# EAGLE schematic 15TB (EAGLE 9.6.0), part 1 of 2

## Sheet 1 of 4
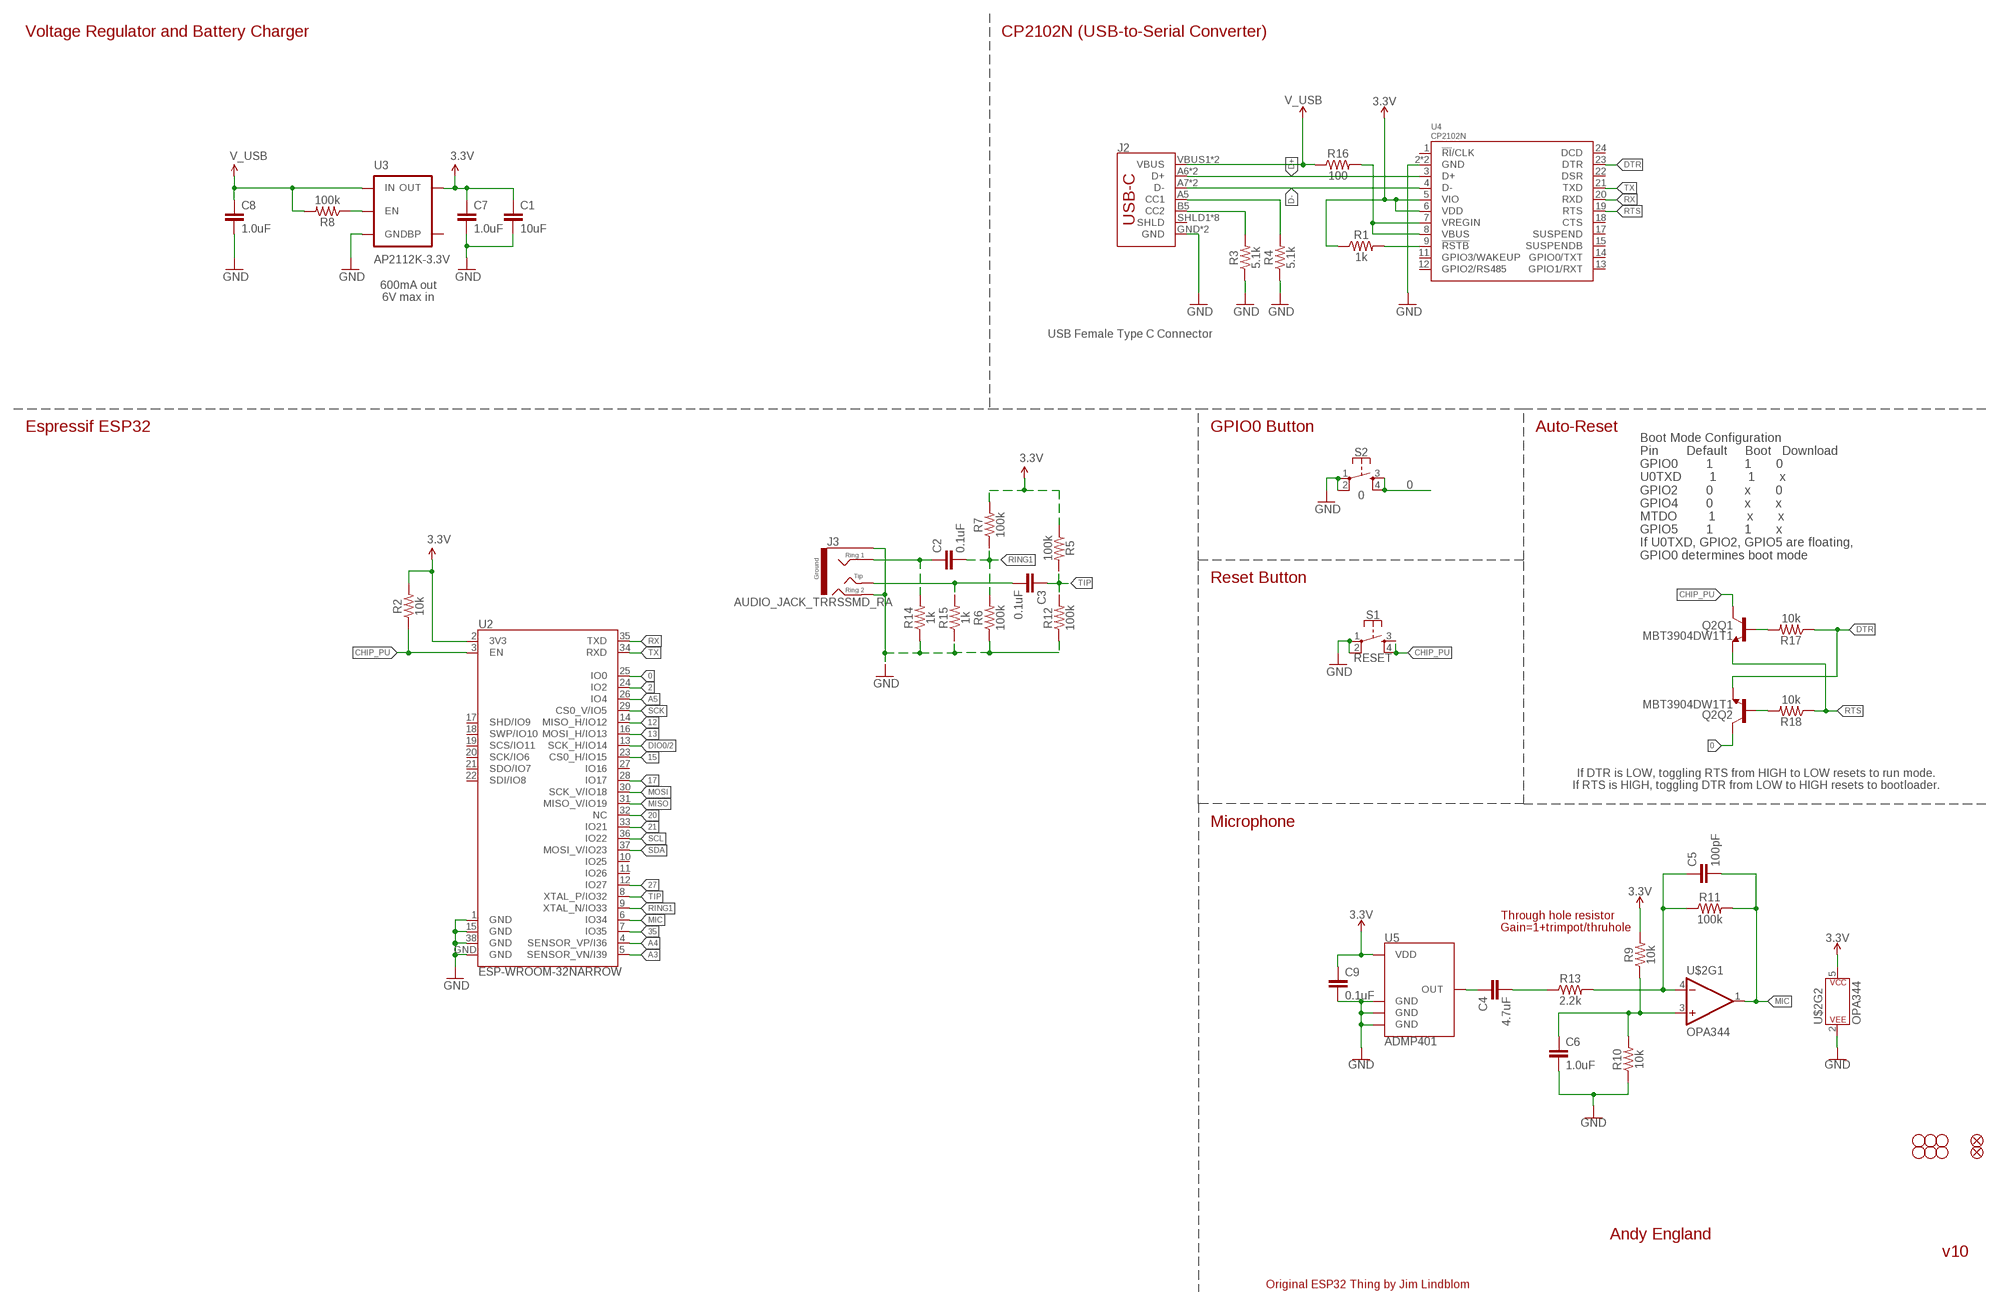
[diagram p0: schematic, sheet 1]

### Parts
C1  10uF  10UF-0603-6.3V-20%  [0603]
C2  0.1uF  0.1UF-0603-25V-5%  [0603]
C3  0.1uF  0.1UF-0603-25V-5%  [0603]
C4  4.7uF  4.7UF-0603-6.3V-(10%)  [0603]
C5  100pF  100PF-0603-50V-5%  [0603]
C6  1.0uF  1.0UF-0603-16V-10%  [0603]
C7  1.0uF  1.0UF-0603-16V-10%  [0603]
C8  1.0uF  1.0UF-0603-16V-10%  [0603]
C9  0.1uF  0.1UF-0603-25V-5%  [0603]
FD1  FIDUCIALUFIDUCIAL  [FIDUCIAL-MICRO]
FD4  FIDUCIALUFIDUCIAL  [FIDUCIAL-MICRO]
H1  STAND-OFF  [STAND-OFF]
H2  STAND-OFF  [STAND-OFF]
H3  STAND-OFF  [STAND-OFF]
H4  STAND-OFF  [STAND-OFF]
H5  STAND-OFF  [STAND-OFF]
H6  STAND-OFF  [STAND-OFF]
J2  USB Female Type C Connector  USB_C  [USB-C-16P]
J3  AUDIO_JACK_TRRSSMD_RA  [AUDIO_JACK_3.5MM_TRRS_SMD_RA]
Q2  MBT3904DW1T1  TRANS_NPN_DUAL-MBT3904DW1T1  [SC70-6]
R1  1k  1KOHM-0603-1/10W-1%  [0603]
R2  10k  10KOHM-0603-1/10W-1%  [0603]
R3  5.1k  5.1KOHM5.1KOHM-0603-1/10W-1%  [0603]
R4  5.1k  5.1KOHM5.1KOHM-0603-1/10W-1%  [0603]
R5  100k  100KOHM-0603-1/10W-1%  [0603]
R6  100k  100KOHM-0603-1/10W-1%  [0603]
R7  100k  100KOHM-0603-1/10W-1%  [0603]
R8  100k  100KOHM-0603-1/10W-1%  [0603]
R9  10k  10KOHM-0603-1/10W-1%  [0603]
R10  10k  10KOHM-0603-1/10W-1%  [0603]
R11  100k  100KOHM-0603-1/10W-1%  [0603]
R12  100k  100KOHM-0603-1/10W-1%  [0603]
R13  2.2k  2.2KOHM-0603-1/10W-1%  [0603]
R14  1k  1KOHM-0603-1/10W-1%  [0603]
R15  1k  1KOHM-0603-1/10W-1%  [0603]
R16  100  100OHM-0603-1/10W-1%  [0603]
R17  10k  10KOHM-0603-1/10W-1%  [0603]
R18  10k  10KOHM-0603-1/10W-1%  [0603]
S1  RESET  MOMENTARY-SWITCH-SPST-2-SMD-4.6X2.8MM  [TACTILE_SWITCH_SMD_4.6X2.8MM]
S2  0  MOMENTARY-SWITCH-SPST-2-SMD-4.6X2.8MM  [TACTILE_SWITCH_SMD_4.6X2.8MM]
U2  ESP-WROOM-32NARROW  [ESP-WROOM-32-NARROW]
U3  AP2112K-3.3V  V_REG_LDOSMD  [SOT23-5]
U4  CP2102N  [QFN24]
U5  ADMP401  [ADMP401]
U$2  OPA344  [SOT23-5]

### Nets
0: Q2.6(Q2:C) S2.3 S2.4 U2.25(IO0)
2: U2.24(IO2)
3.3V: C1.1 C7.1 C9.1 R1.1 R2.2 R5.1 R7.2 R9.2 U2.2(3V3) U3.5(OUT) U4.5(VIO) U4.6(VDD) U5.5(VDD) U$2.5(P$V+)
12: U2.14(MISO_H/IO12)
13: U2.16(MOSI_H/IO13)
15: U2.23(CS0_H/IO15)
17: U2.28(IO17)
20: U2.32(NC)
21: U2.33(IO21)
27: U2.12(IO27)
35: U2.7(IO35)
A3: U2.5(SENSOR_VN/I39)
A4: U2.4(SENSOR_VP/I36)
A5: U2.26(IO4)
CHIP_PU: Q2.3(Q1:C) R2.1 S1.3 S1.4 U2.3(EN)
D+: J2.A6(D+) J2.B6(D+) U4.3(D+)
D-: J2.A7(D-) J2.B7(D-) U4.4(D-)
DIO0: U2.13(SCK_H/IO14) ; also sheet 2,4
DTR: Q2.1(Q2:E) R17.1 U4.23(DTR)
EN: R8.1 U3.3(EN)
GND: C1.2 C6.2 C7.2 C8.2 C9.2 J2.GND J2.GND2(GND) J3.EARTH J3.RING2 R3.1 R4.1 R6.1 R10.1 R12.1 R14.1 R15.1 S1.1 S1.2 S2.1 S2.2 U2.1(GND) U2.15(GND) U2.38(GND) U2.GND U3.2(GND) U4.2(GND) U4.PAD(GND) U5.2(GND) U5.4(GND) U5.6(GND) U$2.2(P$V-) ; also sheet 2,3,4
MIC: C5.2 R11.2 U2.6(IO34) U$2.1(OUT)
MISO: U2.31(MISO_V/IO19)
MOSI: U2.30(SCK_V/IO18)
N$1: R1.2 U4.9(!RSTB)
N$3: J2.B5(CC2) R3.2
N$4: J2.A5(CC1) R4.2
N$5: C4.1 U5.1(OUT)
N$6: C3.2 J3.TIP R15.2
N$7: C2.1 J3.RING1 R14.2
N$9: C5.1 R11.1 R13.2 U$2.4(-IN)
N$10: Q2.5(Q1:B) R17.2
N$11: C4.2 R13.1
N$12: Q2.2(Q2:B) R18.2
N$16: C6.1 R9.1 R10.2 U$2.3(+IN)
N$137: R16.2 U4.7(VREGIN) U4.8(VBUS)
RING1: C2.2 R6.2 R7.1 U2.9(XTAL_N/IO33)
RTS: Q2.4(Q1:E) R18.1 U4.19(RTS)
RX: U2.35(TXD) U4.20(RXD)
SCK: U2.29(CS0_V/IO5)
SCL: U2.36(IO22)
SDA: U2.37(MOSI_V/IO23)
TIP: C3.1 R5.2 R12.2 U2.8(XTAL_P/IO32)
TX: U2.34(RXD) U4.21(TXD)
V_USB: C8.1 J2.VBUS1(VBUS) J2.VBUS2(VBUS) R8.2 R16.1 U3.1(IN) ; also sheet 2,3,4
Unconnected: J2.SHLD1(SHLD) J2.SHLD2(SHLD) J2.SHLD3(SHLD) J2.SHLD4(SHLD) J2.SHLD5(SHLD) J2.SHLD6(SHLD) J2.SHLD7(SHLD) J2.SHLD8(SHLD) U2.10(IO25) U2.11(IO26) U2.17(SHD/IO9) U2.18(SWP/IO10) U2.19(SCS/IO11) U2.20(SCK/IO6) U2.21(SDO/IO7) U2.22(SDI/IO8) U2.27(IO16) U3.4(BP) U4.1(!RI!/CLK) U4.11(GPIO3/WAKEUP) U4.12(GPIO2/RS485) U4.13(GPIO1/RXT) U4.14(GPIO0/TXT) U4.15(SUSPENDB) U4.17(SUSPEND) U4.18(CTS) U4.22(DSR) U4.24(DCD)

### Notes on the sheet
- Voltage Regulator and Battery Charger | CP2102N (USB-to-Serial Converter)
- 600mA out
  6V max in
- Espressif ESP32 | GPIO0 Button | Auto-Reset
- Boot Mode Configuration
  Pin        Default     Boot   Download
  GPIO0        1         1       0
  U0TXD        1         1       x
  GPIO2        0         x       0
  GPIO4        0         x       x
  MTDO         1         x       x
  GPIO5        1         1       x
  If U0TXD, GPIO2, GPIO5 are floating, 
  GPIO0 determines boot mode
- Reset Button
- If DTR is LOW, toggling RTS from HIGH to LOW resets to run mode.
  If RTS is HIGH, toggling DTR from LOW to HIGH resets to bootloader.
- Microphone
- Through hole resistor
  Gain=1+trimpot/thruhole
- Andy England
- v10
- Original ESP32 Thing by Jim Lindblom

## Sheet 2 of 4
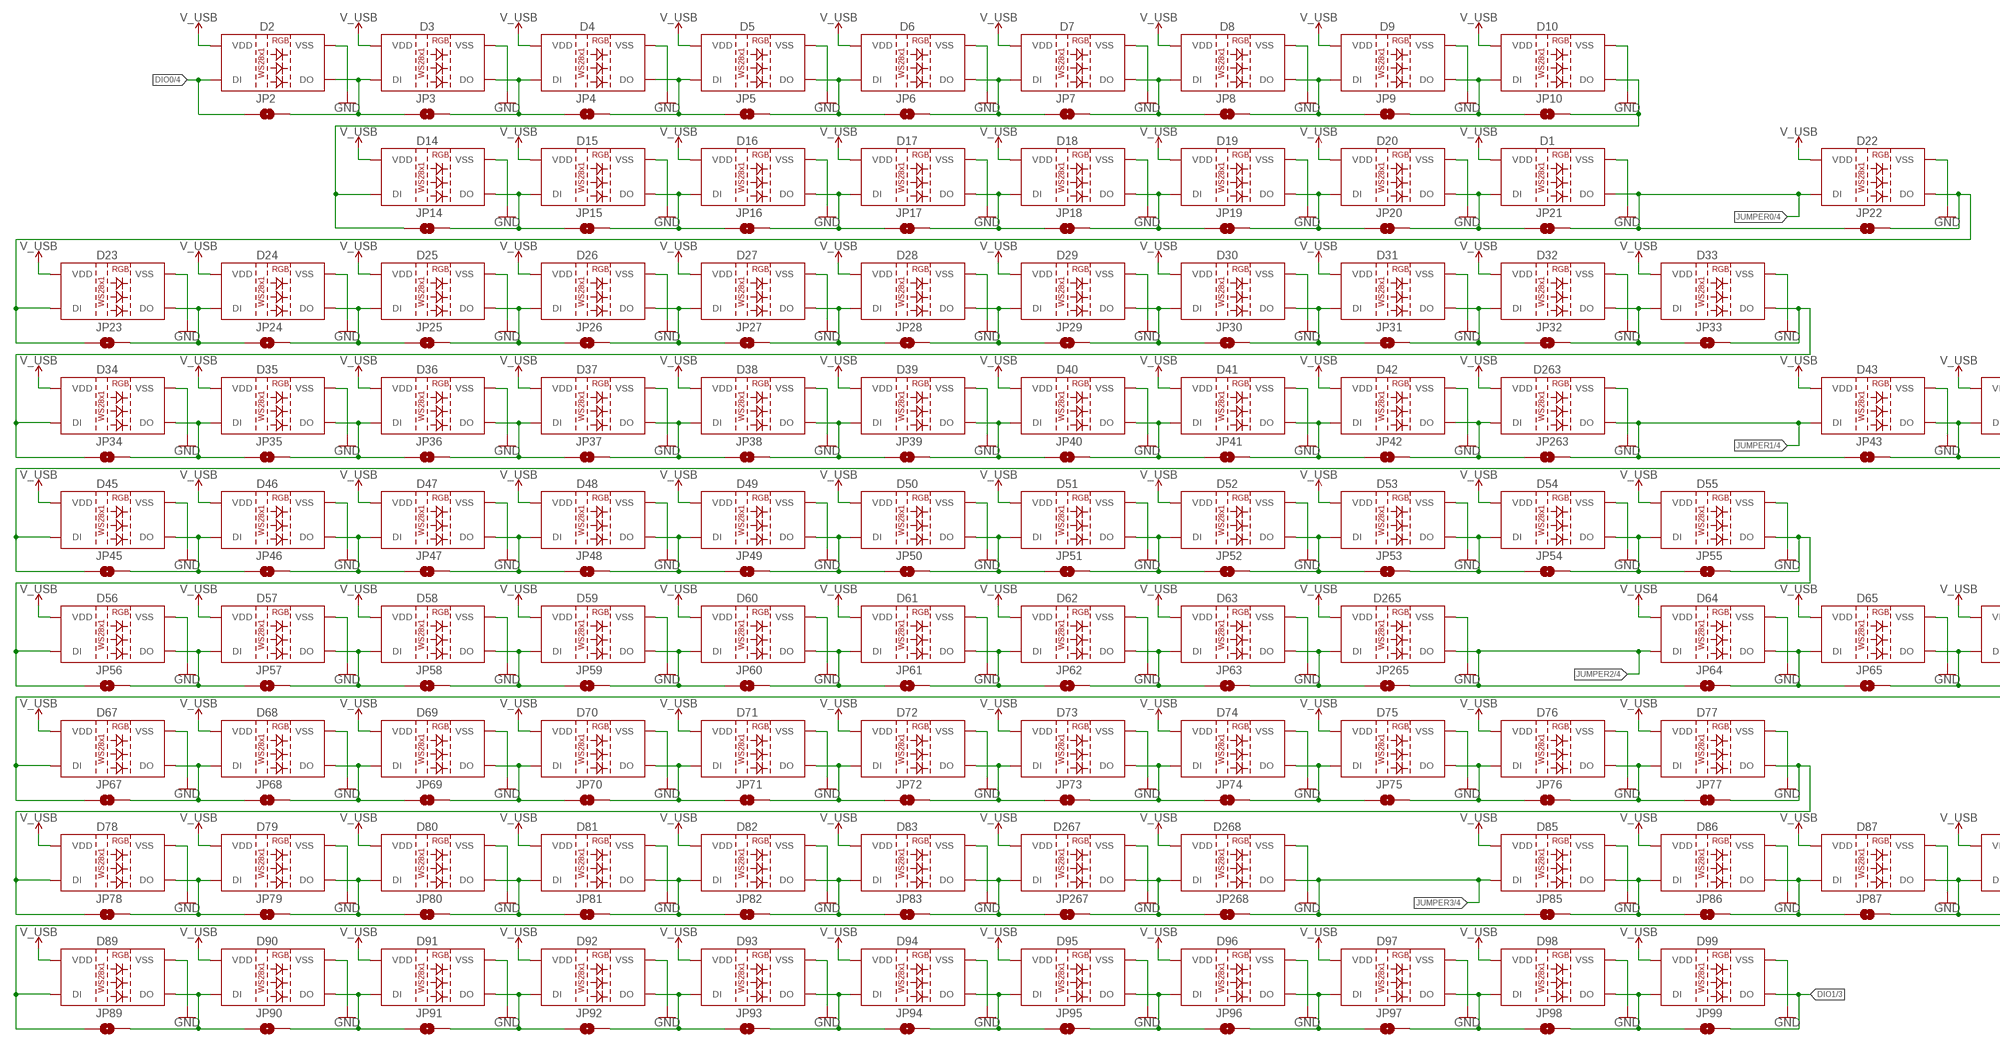
[diagram p1: schematic, sheet 2, part 1 of 2]
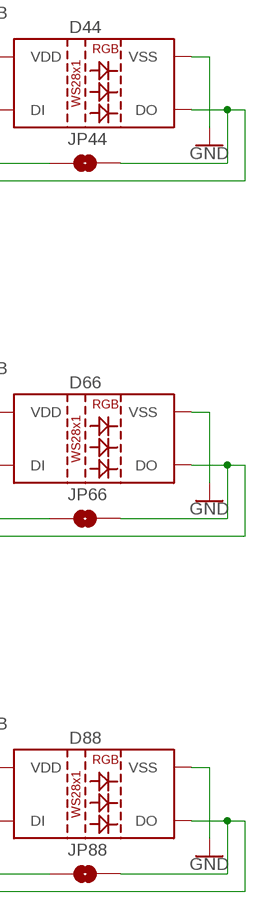
[diagram p2: schematic, sheet 2, part 2 of 2]

### Parts
D1  WS2812B  [WS2812B]
D2  WS2812B  [WS2812B]
D3  WS2812B  [WS2812B]
D4  WS2812B  [WS2812B]
D5  WS2812B  [WS2812B]
D6  WS2812B  [WS2812B]
D7  WS2812B  [WS2812B]
D8  WS2812B  [WS2812B]
D9  WS2812B  [WS2812B]
D10  WS2812B  [WS2812B]
D14  WS2812B  [WS2812B]
D15  WS2812B  [WS2812B]
D16  WS2812B  [WS2812B]
D17  WS2812B  [WS2812B]
D18  WS2812B  [WS2812B]
D19  WS2812B  [WS2812B]
D20  WS2812B  [WS2812B]
D22  WS2812B  [WS2812B]
D23  WS2812B  [WS2812B]
D24  WS2812B  [WS2812B]
D25  WS2812B  [WS2812B]
D26  WS2812B  [WS2812B]
D27  WS2812B  [WS2812B]
D28  WS2812B  [WS2812B]
D29  WS2812B  [WS2812B]
D30  WS2812B  [WS2812B]
D31  WS2812B  [WS2812B]
D32  WS2812B  [WS2812B]
D33  WS2812B  [WS2812B]
D34  WS2812B  [WS2812B]
D35  WS2812B  [WS2812B]
D36  WS2812B  [WS2812B]
D37  WS2812B  [WS2812B]
D38  WS2812B  [WS2812B]
D39  WS2812B  [WS2812B]
D40  WS2812B  [WS2812B]
D41  WS2812B  [WS2812B]
D42  WS2812B  [WS2812B]
D43  WS2812B  [WS2812B]
D44  WS2812B  [WS2812B]
D45  WS2812B  [WS2812B]
D46  WS2812B  [WS2812B]
D47  WS2812B  [WS2812B]
D48  WS2812B  [WS2812B]
D49  WS2812B  [WS2812B]
D50  WS2812B  [WS2812B]
D51  WS2812B  [WS2812B]
D52  WS2812B  [WS2812B]
D53  WS2812B  [WS2812B]
D54  WS2812B  [WS2812B]
D55  WS2812B  [WS2812B]
D56  WS2812B  [WS2812B]
D57  WS2812B  [WS2812B]
D58  WS2812B  [WS2812B]
D59  WS2812B  [WS2812B]
D60  WS2812B  [WS2812B]
D61  WS2812B  [WS2812B]
D62  WS2812B  [WS2812B]
D63  WS2812B  [WS2812B]
D64  WS2812B  [WS2812B]
D65  WS2812B  [WS2812B]
D66  WS2812B  [WS2812B]
D67  WS2812B  [WS2812B]
D68  WS2812B  [WS2812B]
D69  WS2812B  [WS2812B]
D70  WS2812B  [WS2812B]
D71  WS2812B  [WS2812B]
D72  WS2812B  [WS2812B]
D73  WS2812B  [WS2812B]
D74  WS2812B  [WS2812B]
D75  WS2812B  [WS2812B]
D76  WS2812B  [WS2812B]
D77  WS2812B  [WS2812B]
D78  WS2812B  [WS2812B]
D79  WS2812B  [WS2812B]
D80  WS2812B  [WS2812B]
D81  WS2812B  [WS2812B]
D82  WS2812B  [WS2812B]
D83  WS2812B  [WS2812B]
D85  WS2812B  [WS2812B]
D86  WS2812B  [WS2812B]
D87  WS2812B  [WS2812B]
D88  WS2812B  [WS2812B]
D89  WS2812B  [WS2812B]
D90  WS2812B  [WS2812B]
D91  WS2812B  [WS2812B]
D92  WS2812B  [WS2812B]
D93  WS2812B  [WS2812B]
D94  WS2812B  [WS2812B]
D95  WS2812B  [WS2812B]
D96  WS2812B  [WS2812B]
D97  WS2812B  [WS2812B]
D98  WS2812B  [WS2812B]
D99  WS2812B  [WS2812B]
D263  WS2812B  [WS2812B]
D265  WS2812B  [WS2812B]
D267  WS2812B  [WS2812B]
D268  WS2812B  [WS2812B]
JP2  JUMPER-SMT_2_NO_NO-SILK  [SMT-JUMPER_2_NO_NO-SILK]
JP3  JUMPER-SMT_2_NO_NO-SILK  [SMT-JUMPER_2_NO_NO-SILK]
JP4  JUMPER-SMT_2_NO_NO-SILK  [SMT-JUMPER_2_NO_NO-SILK]
JP5  JUMPER-SMT_2_NO_NO-SILK  [SMT-JUMPER_2_NO_NO-SILK]
JP6  JUMPER-SMT_2_NO_NO-SILK  [SMT-JUMPER_2_NO_NO-SILK]
JP7  JUMPER-SMT_2_NO_NO-SILK  [SMT-JUMPER_2_NO_NO-SILK]
JP8  JUMPER-SMT_2_NO_NO-SILK  [SMT-JUMPER_2_NO_NO-SILK]
JP9  JUMPER-SMT_2_NO_NO-SILK  [SMT-JUMPER_2_NO_NO-SILK]
JP10  JUMPER-SMT_2_NO_NO-SILK  [SMT-JUMPER_2_NO_NO-SILK]
JP14  JUMPER-SMT_2_NO_NO-SILK  [SMT-JUMPER_2_NO_NO-SILK]
JP15  JUMPER-SMT_2_NO_NO-SILK  [SMT-JUMPER_2_NO_NO-SILK]
JP16  JUMPER-SMT_2_NO_NO-SILK  [SMT-JUMPER_2_NO_NO-SILK]
JP17  JUMPER-SMT_2_NO_NO-SILK  [SMT-JUMPER_2_NO_NO-SILK]
JP18  JUMPER-SMT_2_NO_NO-SILK  [SMT-JUMPER_2_NO_NO-SILK]
JP19  JUMPER-SMT_2_NO_NO-SILK  [SMT-JUMPER_2_NO_NO-SILK]
JP20  JUMPER-SMT_2_NO_NO-SILK  [SMT-JUMPER_2_NO_NO-SILK]
JP21  JUMPER-SMT_2_NO_NO-SILK  [SMT-JUMPER_2_NO_NO-SILK]
JP22  JUMPER-SMT_2_NO_NO-SILK  [SMT-JUMPER_2_NO_NO-SILK]
JP23  JUMPER-SMT_2_NO_NO-SILK  [SMT-JUMPER_2_NO_NO-SILK]
JP24  JUMPER-SMT_2_NO_NO-SILK  [SMT-JUMPER_2_NO_NO-SILK]
JP25  JUMPER-SMT_2_NO_NO-SILK  [SMT-JUMPER_2_NO_NO-SILK]
JP26  JUMPER-SMT_2_NO_NO-SILK  [SMT-JUMPER_2_NO_NO-SILK]
JP27  JUMPER-SMT_2_NO_NO-SILK  [SMT-JUMPER_2_NO_NO-SILK]
JP28  JUMPER-SMT_2_NO_NO-SILK  [SMT-JUMPER_2_NO_NO-SILK]
JP29  JUMPER-SMT_2_NO_NO-SILK  [SMT-JUMPER_2_NO_NO-SILK]
JP30  JUMPER-SMT_2_NO_NO-SILK  [SMT-JUMPER_2_NO_NO-SILK]
JP31  JUMPER-SMT_2_NO_NO-SILK  [SMT-JUMPER_2_NO_NO-SILK]
JP32  JUMPER-SMT_2_NO_NO-SILK  [SMT-JUMPER_2_NO_NO-SILK]
JP33  JUMPER-SMT_2_NO_NO-SILK  [SMT-JUMPER_2_NO_NO-SILK]
JP34  JUMPER-SMT_2_NO_NO-SILK  [SMT-JUMPER_2_NO_NO-SILK]
JP35  JUMPER-SMT_2_NO_NO-SILK  [SMT-JUMPER_2_NO_NO-SILK]
JP36  JUMPER-SMT_2_NO_NO-SILK  [SMT-JUMPER_2_NO_NO-SILK]
JP37  JUMPER-SMT_2_NO_NO-SILK  [SMT-JUMPER_2_NO_NO-SILK]
JP38  JUMPER-SMT_2_NO_NO-SILK  [SMT-JUMPER_2_NO_NO-SILK]
JP39  JUMPER-SMT_2_NO_NO-SILK  [SMT-JUMPER_2_NO_NO-SILK]
JP40  JUMPER-SMT_2_NO_NO-SILK  [SMT-JUMPER_2_NO_NO-SILK]
JP41  JUMPER-SMT_2_NO_NO-SILK  [SMT-JUMPER_2_NO_NO-SILK]
JP42  JUMPER-SMT_2_NO_NO-SILK  [SMT-JUMPER_2_NO_NO-SILK]
JP43  JUMPER-SMT_2_NO_NO-SILK  [SMT-JUMPER_2_NO_NO-SILK]
JP44  JUMPER-SMT_2_NO_NO-SILK  [SMT-JUMPER_2_NO_NO-SILK]
JP45  JUMPER-SMT_2_NO_NO-SILK  [SMT-JUMPER_2_NO_NO-SILK]
JP46  JUMPER-SMT_2_NO_NO-SILK  [SMT-JUMPER_2_NO_NO-SILK]
JP47  JUMPER-SMT_2_NO_NO-SILK  [SMT-JUMPER_2_NO_NO-SILK]
JP48  JUMPER-SMT_2_NO_NO-SILK  [SMT-JUMPER_2_NO_NO-SILK]
JP49  JUMPER-SMT_2_NO_NO-SILK  [SMT-JUMPER_2_NO_NO-SILK]
JP50  JUMPER-SMT_2_NO_NO-SILK  [SMT-JUMPER_2_NO_NO-SILK]
JP51  JUMPER-SMT_2_NO_NO-SILK  [SMT-JUMPER_2_NO_NO-SILK]
JP52  JUMPER-SMT_2_NO_NO-SILK  [SMT-JUMPER_2_NO_NO-SILK]
JP53  JUMPER-SMT_2_NO_NO-SILK  [SMT-JUMPER_2_NO_NO-SILK]
JP54  JUMPER-SMT_2_NO_NO-SILK  [SMT-JUMPER_2_NO_NO-SILK]
JP55  JUMPER-SMT_2_NO_NO-SILK  [SMT-JUMPER_2_NO_NO-SILK]
JP56  JUMPER-SMT_2_NO_NO-SILK  [SMT-JUMPER_2_NO_NO-SILK]
JP57  JUMPER-SMT_2_NO_NO-SILK  [SMT-JUMPER_2_NO_NO-SILK]
JP58  JUMPER-SMT_2_NO_NO-SILK  [SMT-JUMPER_2_NO_NO-SILK]
JP59  JUMPER-SMT_2_NO_NO-SILK  [SMT-JUMPER_2_NO_NO-SILK]
JP60  JUMPER-SMT_2_NO_NO-SILK  [SMT-JUMPER_2_NO_NO-SILK]
JP61  JUMPER-SMT_2_NO_NO-SILK  [SMT-JUMPER_2_NO_NO-SILK]
JP62  JUMPER-SMT_2_NO_NO-SILK  [SMT-JUMPER_2_NO_NO-SILK]
JP63  JUMPER-SMT_2_NO_NO-SILK  [SMT-JUMPER_2_NO_NO-SILK]
JP64  JUMPER-SMT_2_NO_NO-SILK  [SMT-JUMPER_2_NO_NO-SILK]
JP65  JUMPER-SMT_2_NO_NO-SILK  [SMT-JUMPER_2_NO_NO-SILK]
JP66  JUMPER-SMT_2_NO_NO-SILK  [SMT-JUMPER_2_NO_NO-SILK]
JP67  JUMPER-SMT_2_NO_NO-SILK  [SMT-JUMPER_2_NO_NO-SILK]
JP68  JUMPER-SMT_2_NO_NO-SILK  [SMT-JUMPER_2_NO_NO-SILK]
JP69  JUMPER-SMT_2_NO_NO-SILK  [SMT-JUMPER_2_NO_NO-SILK]
JP70  JUMPER-SMT_2_NO_NO-SILK  [SMT-JUMPER_2_NO_NO-SILK]
JP71  JUMPER-SMT_2_NO_NO-SILK  [SMT-JUMPER_2_NO_NO-SILK]
JP72  JUMPER-SMT_2_NO_NO-SILK  [SMT-JUMPER_2_NO_NO-SILK]
JP73  JUMPER-SMT_2_NO_NO-SILK  [SMT-JUMPER_2_NO_NO-SILK]
JP74  JUMPER-SMT_2_NO_NO-SILK  [SMT-JUMPER_2_NO_NO-SILK]
JP75  JUMPER-SMT_2_NO_NO-SILK  [SMT-JUMPER_2_NO_NO-SILK]
JP76  JUMPER-SMT_2_NO_NO-SILK  [SMT-JUMPER_2_NO_NO-SILK]
JP77  JUMPER-SMT_2_NO_NO-SILK  [SMT-JUMPER_2_NO_NO-SILK]
JP78  JUMPER-SMT_2_NO_NO-SILK  [SMT-JUMPER_2_NO_NO-SILK]
JP79  JUMPER-SMT_2_NO_NO-SILK  [SMT-JUMPER_2_NO_NO-SILK]
JP80  JUMPER-SMT_2_NO_NO-SILK  [SMT-JUMPER_2_NO_NO-SILK]
JP81  JUMPER-SMT_2_NO_NO-SILK  [SMT-JUMPER_2_NO_NO-SILK]
JP82  JUMPER-SMT_2_NO_NO-SILK  [SMT-JUMPER_2_NO_NO-SILK]
JP83  JUMPER-SMT_2_NO_NO-SILK  [SMT-JUMPER_2_NO_NO-SILK]
JP85  JUMPER-SMT_2_NO_NO-SILK  [SMT-JUMPER_2_NO_NO-SILK]
JP86  JUMPER-SMT_2_NO_NO-SILK  [SMT-JUMPER_2_NO_NO-SILK]
JP87  JUMPER-SMT_2_NO_NO-SILK  [SMT-JUMPER_2_NO_NO-SILK]
JP88  JUMPER-SMT_2_NO_NO-SILK  [SMT-JUMPER_2_NO_NO-SILK]
JP89  JUMPER-SMT_2_NO_NO-SILK  [SMT-JUMPER_2_NO_NO-SILK]
JP90  JUMPER-SMT_2_NO_NO-SILK  [SMT-JUMPER_2_NO_NO-SILK]
JP91  JUMPER-SMT_2_NO_NO-SILK  [SMT-JUMPER_2_NO_NO-SILK]
JP92  JUMPER-SMT_2_NO_NO-SILK  [SMT-JUMPER_2_NO_NO-SILK]
JP93  JUMPER-SMT_2_NO_NO-SILK  [SMT-JUMPER_2_NO_NO-SILK]
JP94  JUMPER-SMT_2_NO_NO-SILK  [SMT-JUMPER_2_NO_NO-SILK]
JP95  JUMPER-SMT_2_NO_NO-SILK  [SMT-JUMPER_2_NO_NO-SILK]
JP96  JUMPER-SMT_2_NO_NO-SILK  [SMT-JUMPER_2_NO_NO-SILK]
JP97  JUMPER-SMT_2_NO_NO-SILK  [SMT-JUMPER_2_NO_NO-SILK]
JP98  JUMPER-SMT_2_NO_NO-SILK  [SMT-JUMPER_2_NO_NO-SILK]
JP99  JUMPER-SMT_2_NO_NO-SILK  [SMT-JUMPER_2_NO_NO-SILK]
JP263  JUMPER-SMT_2_NO_NO-SILK  [SMT-JUMPER_2_NO_NO-SILK]
JP265  JUMPER-SMT_2_NO_NO-SILK  [SMT-JUMPER_2_NO_NO-SILK]
JP267  JUMPER-SMT_2_NO_NO-SILK  [SMT-JUMPER_2_NO_NO-SILK]
JP268  JUMPER-SMT_2_NO_NO-SILK  [SMT-JUMPER_2_NO_NO-SILK]

### Nets
DIO0: D2.4(DI) JP2.1 ; also sheet 1,4
DIO1: D99.2(DO) JP99.2 ; also sheet 3
DIO3: D6.2(DO) D7.4(DI) JP6.2 JP7.1
DIO4: D8.2(DO) D9.4(DI) JP8.2 JP9.1
DIO7: D15.2(DO) D16.4(DI) JP15.2 JP16.1
DIO8: D17.2(DO) D18.4(DI) JP17.2 JP18.1
DIO9: D19.2(DO) D20.4(DI) JP19.2 JP20.1
DIO11: D22.2(DO) D23.4(DI) JP22.2 JP23.1
DIO12: D24.2(DO) D25.4(DI) JP24.2 JP25.1
DIO13: D26.2(DO) D27.4(DI) JP26.2 JP27.1
DIO14: D28.2(DO) D29.4(DI) JP28.2 JP29.1
DIO15: D30.2(DO) D31.4(DI) JP30.2 JP31.1
DIO16: D32.2(DO) D33.4(DI) JP32.2 JP33.1
DIO17: D33.2(DO) D34.4(DI) JP33.2 JP34.1
DIO18: D35.2(DO) D36.4(DI) JP35.2 JP36.1
DIO19: D37.2(DO) D38.4(DI) JP37.2 JP38.1
DIO20: D39.2(DO) D40.4(DI) JP39.2 JP40.1
DIO21: D41.2(DO) D42.4(DI) JP41.2 JP42.1
DIO22: D43.2(DO) D44.4(DI) JP43.2 JP44.1
DIO23: D44.2(DO) D45.4(DI) JP44.2 JP45.1
DIO24: D46.2(DO) D47.4(DI) JP46.2 JP47.1
DIO25: D48.2(DO) D49.4(DI) JP48.2 JP49.1
DIO26: D50.2(DO) D51.4(DI) JP50.2 JP51.1
DIO27: D52.2(DO) D53.4(DI) JP52.2 JP53.1
DIO28: D54.2(DO) D55.4(DI) JP54.2 JP55.1
DIO29: D55.2(DO) D56.4(DI) JP55.2 JP56.1
DIO30: D57.2(DO) D58.4(DI) JP57.2 JP58.1
DIO31: D59.2(DO) D60.4(DI) JP59.2 JP60.1
DIO32: D61.2(DO) D62.4(DI) JP61.2 JP62.1
DIO33: D267.2(DO) D268.4(DI) JP267.2 JP268.1
DIO34: D65.2(DO) D66.4(DI) JP65.2 JP66.1
DIO35: D66.2(DO) D67.4(DI) JP66.2 JP67.1
DIO36: D68.2(DO) D69.4(DI) JP68.2 JP69.1
DIO37: D70.2(DO) D71.4(DI) JP70.2 JP71.1
DIO38: D72.2(DO) D73.4(DI) JP72.2 JP73.1
DIO39: D74.2(DO) D75.4(DI) JP74.2 JP75.1
DIO40: D76.2(DO) D77.4(DI) JP76.2 JP77.1
DIO41: D77.2(DO) D78.4(DI) JP77.2 JP78.1
DIO42: D79.2(DO) D80.4(DI) JP79.2 JP80.1
DIO43: D81.2(DO) D82.4(DI) JP81.2 JP82.1
DIO45: D85.2(DO) D86.4(DI) JP85.2 JP86.1
DIO46: D87.2(DO) D88.4(DI) JP87.2 JP88.1
DIO47: D88.2(DO) D89.4(DI) JP88.2 JP89.1
DIO48: D90.2(DO) D91.4(DI) JP90.2 JP91.1
DIO49: D92.2(DO) D93.4(DI) JP92.2 JP93.1
DIO50: D94.2(DO) D95.4(DI) JP94.2 JP95.1
DIO51: D96.2(DO) D97.4(DI) JP96.2 JP97.1
DIO52: D98.2(DO) D99.4(DI) JP98.2 JP99.1
GND: D1.3(VSS) D2.3(VSS) D3.3(VSS) D4.3(VSS) D5.3(VSS) D6.3(VSS) D7.3(VSS) D8.3(VSS) D9.3(VSS) D10.3(VSS) D14.3(VSS) D15.3(VSS) D16.3(VSS) D17.3(VSS) D18.3(VSS) D19.3(VSS) D20.3(VSS) D22.3(VSS) D23.3(VSS) D24.3(VSS) D25.3(VSS) D26.3(VSS) D27.3(VSS) D28.3(VSS) D29.3(VSS) D30.3(VSS) D31.3(VSS) D32.3(VSS) D33.3(VSS) D34.3(VSS) D35.3(VSS) D36.3(VSS) D37.3(VSS) D38.3(VSS) D39.3(VSS) D40.3(VSS) D41.3(VSS) D42.3(VSS) D43.3(VSS) D44.3(VSS) D45.3(VSS) D46.3(VSS) D47.3(VSS) D48.3(VSS) D49.3(VSS) D50.3(VSS) D51.3(VSS) D52.3(VSS) D53.3(VSS) D54.3(VSS) D55.3(VSS) D56.3(VSS) D57.3(VSS) D58.3(VSS) D59.3(VSS) D60.3(VSS) D61.3(VSS) D62.3(VSS) D63.3(VSS) D64.3(VSS) D65.3(VSS) D66.3(VSS) D67.3(VSS) D68.3(VSS) D69.3(VSS) D70.3(VSS) D71.3(VSS) D72.3(VSS) D73.3(VSS) D74.3(VSS) D75.3(VSS) D76.3(VSS) D77.3(VSS) D78.3(VSS) D79.3(VSS) D80.3(VSS) D81.3(VSS) D82.3(VSS) D83.3(VSS) D85.3(VSS) D86.3(VSS) D87.3(VSS) D88.3(VSS) D89.3(VSS) D90.3(VSS) D91.3(VSS) D92.3(VSS) D93.3(VSS) D94.3(VSS) D95.3(VSS) D96.3(VSS) D97.3(VSS) D98.3(VSS) D99.3(VSS) D263.3(VSS) D265.3(VSS) D267.3(VSS) D268.3(VSS) ; also sheet 1,3,4
JUMPER0: D1.2(DO) D22.4(DI) JP21.2 JP22.1 ; also sheet 4
JUMPER1: D43.4(DI) D263.2(DO) JP43.1 JP263.2 ; also sheet 4
JUMPER2: D64.4(DI) D265.2(DO) JP64.1 JP265.2 ; also sheet 4
JUMPER3: D85.4(DI) D268.2(DO) JP85.1 JP268.2 ; also sheet 4
N$2: D1.4(DI) D20.2(DO) JP20.2 JP21.1
N$8: D10.2(DO) D14.4(DI) JP10.2 JP14.1
N$13: D3.2(DO) D4.4(DI) JP3.2 JP4.1
N$14: D5.2(DO) D6.4(DI) JP5.2 JP6.1
N$15: D9.2(DO) D10.4(DI) JP9.2 JP10.1
N$17: D7.2(DO) D8.4(DI) JP7.2 JP8.1
N$18: D16.2(DO) D17.4(DI) JP16.2 JP17.1
N$19: D23.2(DO) D24.4(DI) JP23.2 JP24.1
N$20: D14.2(DO) D15.4(DI) JP14.2 JP15.1
N$22: D18.2(DO) D19.4(DI) JP18.2 JP19.1
N$24: D27.2(DO) D28.4(DI) JP27.2 JP28.1
N$25: D25.2(DO) D26.4(DI) JP25.2 JP26.1
N$26: D31.2(DO) D32.4(DI) JP31.2 JP32.1
N$27: D29.2(DO) D30.4(DI) JP29.2 JP30.1
N$29: D34.2(DO) D35.4(DI) JP34.2 JP35.1
N$30: D38.2(DO) D39.4(DI) JP38.2 JP39.1
N$31: D36.2(DO) D37.4(DI) JP36.2 JP37.1
N$32: D42.2(DO) D263.4(DI) JP42.2 JP263.1
N$33: D40.2(DO) D41.4(DI) JP40.2 JP41.1
N$34: D45.2(DO) D46.4(DI) JP45.2 JP46.1
N$35: D49.2(DO) D50.4(DI) JP49.2 JP50.1
N$36: D47.2(DO) D48.4(DI) JP47.2 JP48.1
N$37: D53.2(DO) D54.4(DI) JP53.2 JP54.1
N$38: D51.2(DO) D52.4(DI) JP51.2 JP52.1
N$40: D56.2(DO) D57.4(DI) JP56.2 JP57.1
N$41: D60.2(DO) D61.4(DI) JP60.2 JP61.1
N$42: D58.2(DO) D59.4(DI) JP58.2 JP59.1
N$43: D64.2(DO) D65.4(DI) JP64.2 JP65.1
N$44: D62.2(DO) D63.4(DI) JP62.2 JP63.1
N$45: D67.2(DO) D68.4(DI) JP67.2 JP68.1
N$46: D71.2(DO) D72.4(DI) JP71.2 JP72.1
N$47: D69.2(DO) D70.4(DI) JP69.2 JP70.1
N$48: D75.2(DO) D76.4(DI) JP75.2 JP76.1
N$49: D73.2(DO) D74.4(DI) JP73.2 JP74.1
N$50: D78.2(DO) D79.4(DI) JP78.2 JP79.1
N$51: D82.2(DO) D83.4(DI) JP82.2 JP83.1
N$52: D80.2(DO) D81.4(DI) JP80.2 JP81.1
N$53: D86.2(DO) D87.4(DI) JP86.2 JP87.1
N$55: D89.2(DO) D90.4(DI) JP89.2 JP90.1
N$56: D93.2(DO) D94.4(DI) JP93.2 JP94.1
N$57: D91.2(DO) D92.4(DI) JP91.2 JP92.1
N$58: D97.2(DO) D98.4(DI) JP97.2 JP98.1
N$59: D95.2(DO) D96.4(DI) JP95.2 JP96.1
N$120: D2.2(DO) D3.4(DI) JP2.2 JP3.1
N$121: D4.2(DO) D5.4(DI) JP4.2 JP5.1
N$141: D63.2(DO) D265.4(DI) JP63.2 JP265.1
N$143: D83.2(DO) D267.4(DI) JP83.2 JP267.1
V_USB: D1.1(VDD) D2.1(VDD) D3.1(VDD) D4.1(VDD) D5.1(VDD) D6.1(VDD) D7.1(VDD) D8.1(VDD) D9.1(VDD) D10.1(VDD) D14.1(VDD) D15.1(VDD) D16.1(VDD) D17.1(VDD) D18.1(VDD) D19.1(VDD) D20.1(VDD) D22.1(VDD) D23.1(VDD) D24.1(VDD) D25.1(VDD) D26.1(VDD) D27.1(VDD) D28.1(VDD) D29.1(VDD) D30.1(VDD) D31.1(VDD) D32.1(VDD) D33.1(VDD) D34.1(VDD) D35.1(VDD) D36.1(VDD) D37.1(VDD) D38.1(VDD) D39.1(VDD) D40.1(VDD) D41.1(VDD) D42.1(VDD) D43.1(VDD) D44.1(VDD) D45.1(VDD) D46.1(VDD) D47.1(VDD) D48.1(VDD) D49.1(VDD) D50.1(VDD) D51.1(VDD) D52.1(VDD) D53.1(VDD) D54.1(VDD) D55.1(VDD) D56.1(VDD) D57.1(VDD) D58.1(VDD) D59.1(VDD) D60.1(VDD) D61.1(VDD) D62.1(VDD) D63.1(VDD) D64.1(VDD) D65.1(VDD) D66.1(VDD) D67.1(VDD) D68.1(VDD) D69.1(VDD) D70.1(VDD) D71.1(VDD) D72.1(VDD) D73.1(VDD) D74.1(VDD) D75.1(VDD) D76.1(VDD) D77.1(VDD) D78.1(VDD) D79.1(VDD) D80.1(VDD) D81.1(VDD) D82.1(VDD) D83.1(VDD) D85.1(VDD) D86.1(VDD) D87.1(VDD) D88.1(VDD) D89.1(VDD) D90.1(VDD) D91.1(VDD) D92.1(VDD) D93.1(VDD) D94.1(VDD) D95.1(VDD) D96.1(VDD) D97.1(VDD) D98.1(VDD) D99.1(VDD) D263.1(VDD) D265.1(VDD) D267.1(VDD) D268.1(VDD) ; also sheet 1,3,4

## Sheet 3 of 4
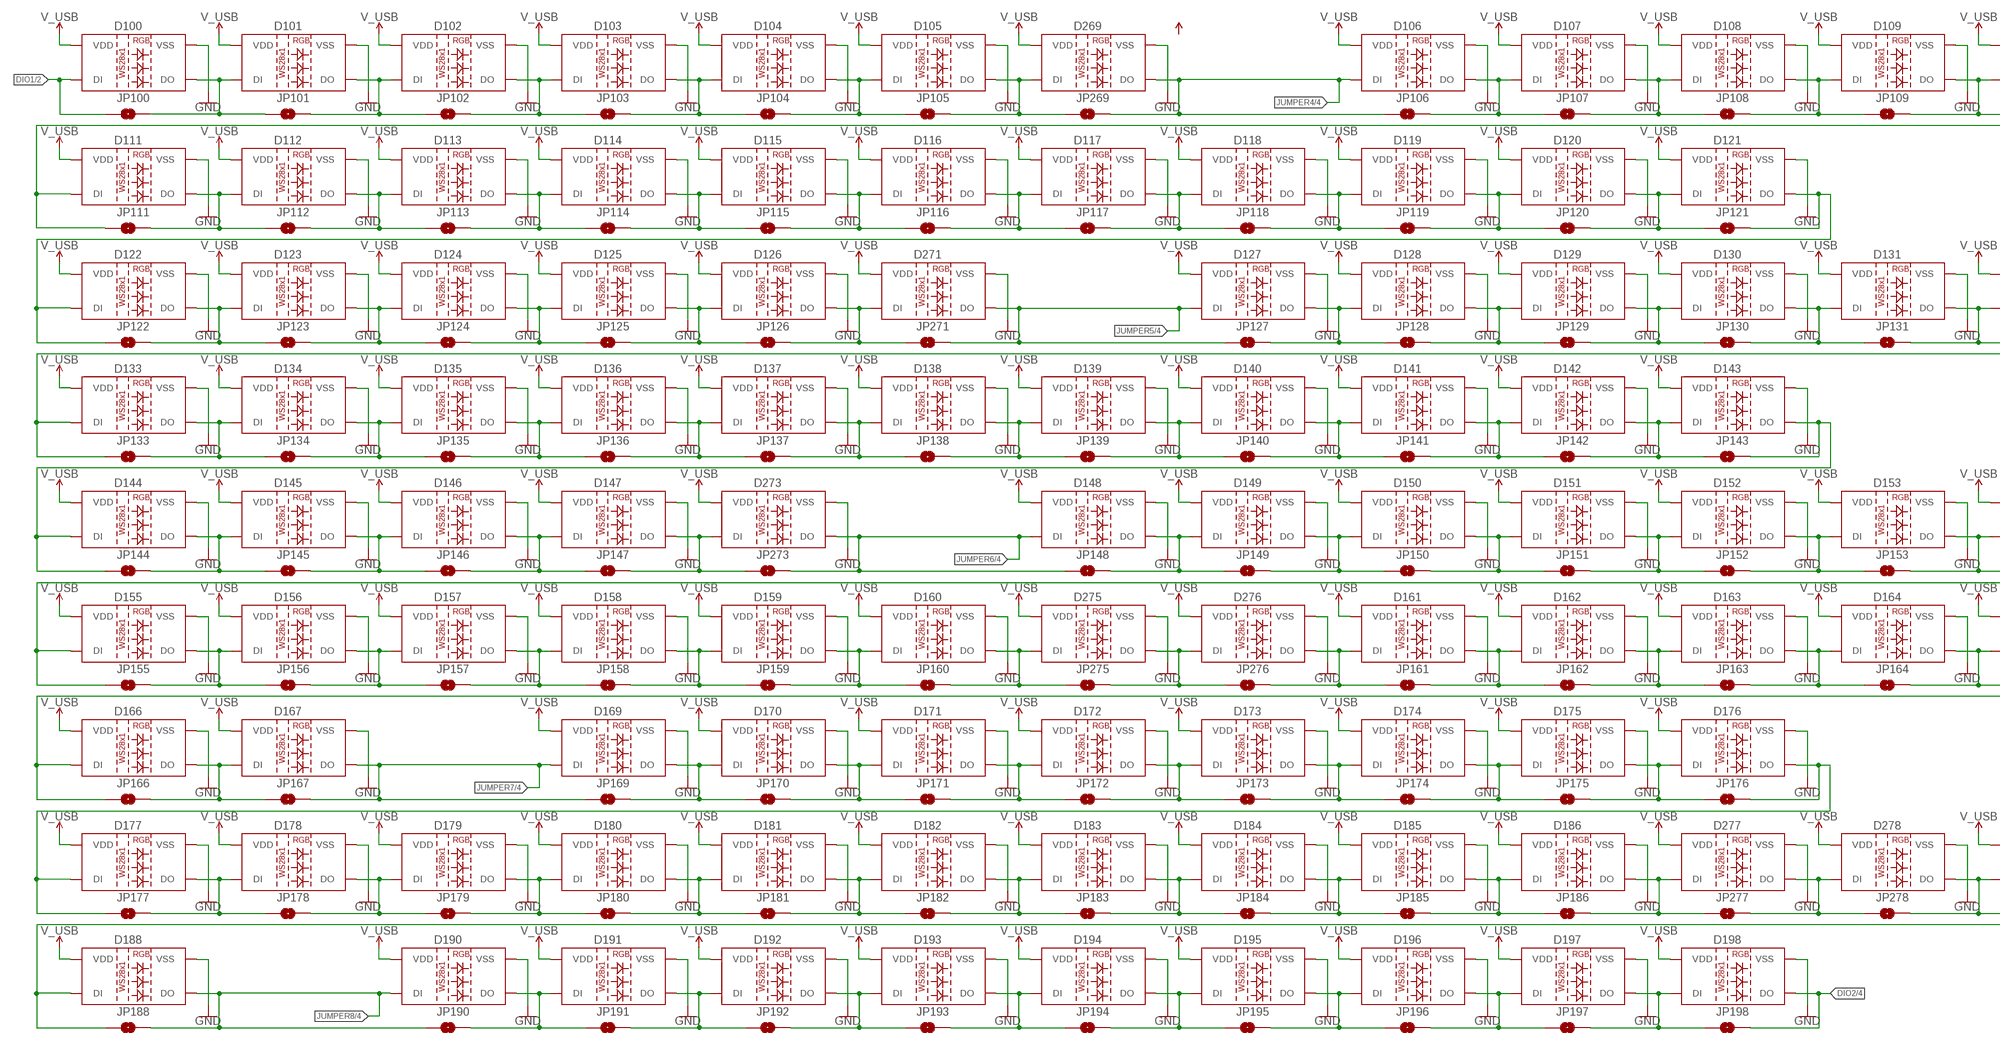
[diagram p3: schematic, sheet 3, part 1 of 2]
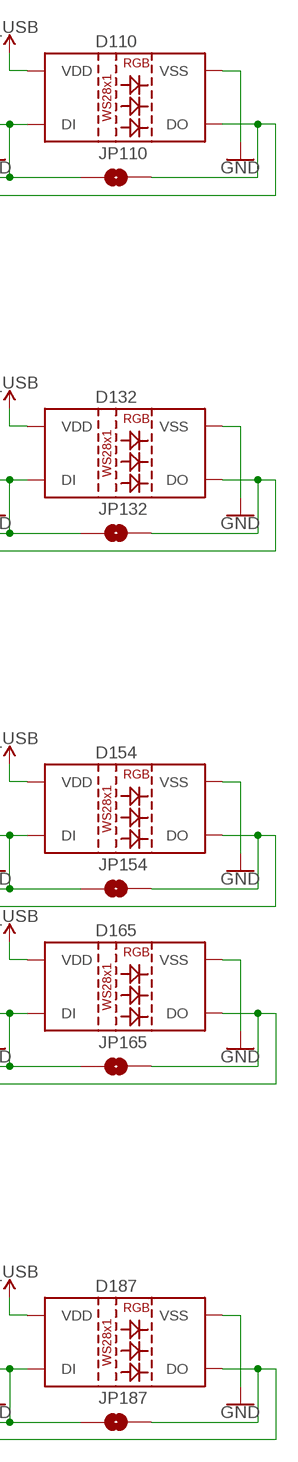
[diagram p4: schematic, sheet 3, part 2 of 2]

### Parts
D100  WS2812B  [WS2812B]
D101  WS2812B  [WS2812B]
D102  WS2812B  [WS2812B]
D103  WS2812B  [WS2812B]
D104  WS2812B  [WS2812B]
D105  WS2812B  [WS2812B]
D106  WS2812B  [WS2812B]
D107  WS2812B  [WS2812B]
D108  WS2812B  [WS2812B]
D109  WS2812B  [WS2812B]
D110  WS2812B  [WS2812B]
D111  WS2812B  [WS2812B]
D112  WS2812B  [WS2812B]
D113  WS2812B  [WS2812B]
D114  WS2812B  [WS2812B]
D115  WS2812B  [WS2812B]
D116  WS2812B  [WS2812B]
D117  WS2812B  [WS2812B]
D118  WS2812B  [WS2812B]
D119  WS2812B  [WS2812B]
D120  WS2812B  [WS2812B]
D121  WS2812B  [WS2812B]
D122  WS2812B  [WS2812B]
D123  WS2812B  [WS2812B]
D124  WS2812B  [WS2812B]
D125  WS2812B  [WS2812B]
D126  WS2812B  [WS2812B]
D127  WS2812B  [WS2812B]
D128  WS2812B  [WS2812B]
D129  WS2812B  [WS2812B]
D130  WS2812B  [WS2812B]
D131  WS2812B  [WS2812B]
D132  WS2812B  [WS2812B]
D133  WS2812B  [WS2812B]
D134  WS2812B  [WS2812B]
D135  WS2812B  [WS2812B]
D136  WS2812B  [WS2812B]
D137  WS2812B  [WS2812B]
D138  WS2812B  [WS2812B]
D139  WS2812B  [WS2812B]
D140  WS2812B  [WS2812B]
D141  WS2812B  [WS2812B]
D142  WS2812B  [WS2812B]
D143  WS2812B  [WS2812B]
D144  WS2812B  [WS2812B]
D145  WS2812B  [WS2812B]
D146  WS2812B  [WS2812B]
D147  WS2812B  [WS2812B]
D148  WS2812B  [WS2812B]
D149  WS2812B  [WS2812B]
D150  WS2812B  [WS2812B]
D151  WS2812B  [WS2812B]
D152  WS2812B  [WS2812B]
D153  WS2812B  [WS2812B]
D154  WS2812B  [WS2812B]
D155  WS2812B  [WS2812B]
D156  WS2812B  [WS2812B]
D157  WS2812B  [WS2812B]
D158  WS2812B  [WS2812B]
D159  WS2812B  [WS2812B]
D160  WS2812B  [WS2812B]
D161  WS2812B  [WS2812B]
D162  WS2812B  [WS2812B]
D163  WS2812B  [WS2812B]
D164  WS2812B  [WS2812B]
D165  WS2812B  [WS2812B]
D166  WS2812B  [WS2812B]
D167  WS2812B  [WS2812B]
D169  WS2812B  [WS2812B]
D170  WS2812B  [WS2812B]
D171  WS2812B  [WS2812B]
D172  WS2812B  [WS2812B]
D173  WS2812B  [WS2812B]
D174  WS2812B  [WS2812B]
D175  WS2812B  [WS2812B]
D176  WS2812B  [WS2812B]
D177  WS2812B  [WS2812B]
D178  WS2812B  [WS2812B]
D179  WS2812B  [WS2812B]
D180  WS2812B  [WS2812B]
D181  WS2812B  [WS2812B]
D182  WS2812B  [WS2812B]
D183  WS2812B  [WS2812B]
D184  WS2812B  [WS2812B]
D185  WS2812B  [WS2812B]
D186  WS2812B  [WS2812B]
D187  WS2812B  [WS2812B]
D188  WS2812B  [WS2812B]
D190  WS2812B  [WS2812B]
D191  WS2812B  [WS2812B]
D192  WS2812B  [WS2812B]
D193  WS2812B  [WS2812B]
D194  WS2812B  [WS2812B]
D195  WS2812B  [WS2812B]
D196  WS2812B  [WS2812B]
D197  WS2812B  [WS2812B]
D198  WS2812B  [WS2812B]
D269  WS2812B  [WS2812B]
D271  WS2812B  [WS2812B]
D273  WS2812B  [WS2812B]
D275  WS2812B  [WS2812B]
D276  WS2812B  [WS2812B]
D277  WS2812B  [WS2812B]
D278  WS2812B  [WS2812B]
JP100  JUMPER-SMT_2_NO_NO-SILK  [SMT-JUMPER_2_NO_NO-SILK]
JP101  JUMPER-SMT_2_NO_NO-SILK  [SMT-JUMPER_2_NO_NO-SILK]
JP102  JUMPER-SMT_2_NO_NO-SILK  [SMT-JUMPER_2_NO_NO-SILK]
JP103  JUMPER-SMT_2_NO_NO-SILK  [SMT-JUMPER_2_NO_NO-SILK]
JP104  JUMPER-SMT_2_NO_NO-SILK  [SMT-JUMPER_2_NO_NO-SILK]
JP105  JUMPER-SMT_2_NO_NO-SILK  [SMT-JUMPER_2_NO_NO-SILK]
JP106  JUMPER-SMT_2_NO_NO-SILK  [SMT-JUMPER_2_NO_NO-SILK]
JP107  JUMPER-SMT_2_NO_NO-SILK  [SMT-JUMPER_2_NO_NO-SILK]
JP108  JUMPER-SMT_2_NO_NO-SILK  [SMT-JUMPER_2_NO_NO-SILK]
JP109  JUMPER-SMT_2_NO_NO-SILK  [SMT-JUMPER_2_NO_NO-SILK]
JP110  JUMPER-SMT_2_NO_NO-SILK  [SMT-JUMPER_2_NO_NO-SILK]
JP111  JUMPER-SMT_2_NO_NO-SILK  [SMT-JUMPER_2_NO_NO-SILK]
JP112  JUMPER-SMT_2_NO_NO-SILK  [SMT-JUMPER_2_NO_NO-SILK]
JP113  JUMPER-SMT_2_NO_NO-SILK  [SMT-JUMPER_2_NO_NO-SILK]
JP114  JUMPER-SMT_2_NO_NO-SILK  [SMT-JUMPER_2_NO_NO-SILK]
JP115  JUMPER-SMT_2_NO_NO-SILK  [SMT-JUMPER_2_NO_NO-SILK]
JP116  JUMPER-SMT_2_NO_NO-SILK  [SMT-JUMPER_2_NO_NO-SILK]
JP117  JUMPER-SMT_2_NO_NO-SILK  [SMT-JUMPER_2_NO_NO-SILK]
JP118  JUMPER-SMT_2_NO_NO-SILK  [SMT-JUMPER_2_NO_NO-SILK]
JP119  JUMPER-SMT_2_NO_NO-SILK  [SMT-JUMPER_2_NO_NO-SILK]
JP120  JUMPER-SMT_2_NO_NO-SILK  [SMT-JUMPER_2_NO_NO-SILK]
JP121  JUMPER-SMT_2_NO_NO-SILK  [SMT-JUMPER_2_NO_NO-SILK]
JP122  JUMPER-SMT_2_NO_NO-SILK  [SMT-JUMPER_2_NO_NO-SILK]
JP123  JUMPER-SMT_2_NO_NO-SILK  [SMT-JUMPER_2_NO_NO-SILK]
JP124  JUMPER-SMT_2_NO_NO-SILK  [SMT-JUMPER_2_NO_NO-SILK]
JP125  JUMPER-SMT_2_NO_NO-SILK  [SMT-JUMPER_2_NO_NO-SILK]
JP126  JUMPER-SMT_2_NO_NO-SILK  [SMT-JUMPER_2_NO_NO-SILK]
JP127  JUMPER-SMT_2_NO_NO-SILK  [SMT-JUMPER_2_NO_NO-SILK]
JP128  JUMPER-SMT_2_NO_NO-SILK  [SMT-JUMPER_2_NO_NO-SILK]
JP129  JUMPER-SMT_2_NO_NO-SILK  [SMT-JUMPER_2_NO_NO-SILK]
JP130  JUMPER-SMT_2_NO_NO-SILK  [SMT-JUMPER_2_NO_NO-SILK]
JP131  JUMPER-SMT_2_NO_NO-SILK  [SMT-JUMPER_2_NO_NO-SILK]
JP132  JUMPER-SMT_2_NO_NO-SILK  [SMT-JUMPER_2_NO_NO-SILK]
JP133  JUMPER-SMT_2_NO_NO-SILK  [SMT-JUMPER_2_NO_NO-SILK]
JP134  JUMPER-SMT_2_NO_NO-SILK  [SMT-JUMPER_2_NO_NO-SILK]
JP135  JUMPER-SMT_2_NO_NO-SILK  [SMT-JUMPER_2_NO_NO-SILK]
JP136  JUMPER-SMT_2_NO_NO-SILK  [SMT-JUMPER_2_NO_NO-SILK]
JP137  JUMPER-SMT_2_NO_NO-SILK  [SMT-JUMPER_2_NO_NO-SILK]
JP138  JUMPER-SMT_2_NO_NO-SILK  [SMT-JUMPER_2_NO_NO-SILK]
JP139  JUMPER-SMT_2_NO_NO-SILK  [SMT-JUMPER_2_NO_NO-SILK]
JP140  JUMPER-SMT_2_NO_NO-SILK  [SMT-JUMPER_2_NO_NO-SILK]
JP141  JUMPER-SMT_2_NO_NO-SILK  [SMT-JUMPER_2_NO_NO-SILK]
JP142  JUMPER-SMT_2_NO_NO-SILK  [SMT-JUMPER_2_NO_NO-SILK]
JP143  JUMPER-SMT_2_NO_NO-SILK  [SMT-JUMPER_2_NO_NO-SILK]
JP144  JUMPER-SMT_2_NO_NO-SILK  [SMT-JUMPER_2_NO_NO-SILK]
JP145  JUMPER-SMT_2_NO_NO-SILK  [SMT-JUMPER_2_NO_NO-SILK]
JP146  JUMPER-SMT_2_NO_NO-SILK  [SMT-JUMPER_2_NO_NO-SILK]
JP147  JUMPER-SMT_2_NO_NO-SILK  [SMT-JUMPER_2_NO_NO-SILK]
JP148  JUMPER-SMT_2_NO_NO-SILK  [SMT-JUMPER_2_NO_NO-SILK]
JP149  JUMPER-SMT_2_NO_NO-SILK  [SMT-JUMPER_2_NO_NO-SILK]
JP150  JUMPER-SMT_2_NO_NO-SILK  [SMT-JUMPER_2_NO_NO-SILK]
JP151  JUMPER-SMT_2_NO_NO-SILK  [SMT-JUMPER_2_NO_NO-SILK]
JP152  JUMPER-SMT_2_NO_NO-SILK  [SMT-JUMPER_2_NO_NO-SILK]
JP153  JUMPER-SMT_2_NO_NO-SILK  [SMT-JUMPER_2_NO_NO-SILK]
JP154  JUMPER-SMT_2_NO_NO-SILK  [SMT-JUMPER_2_NO_NO-SILK]
JP155  JUMPER-SMT_2_NO_NO-SILK  [SMT-JUMPER_2_NO_NO-SILK]
JP156  JUMPER-SMT_2_NO_NO-SILK  [SMT-JUMPER_2_NO_NO-SILK]
JP157  JUMPER-SMT_2_NO_NO-SILK  [SMT-JUMPER_2_NO_NO-SILK]
JP158  JUMPER-SMT_2_NO_NO-SILK  [SMT-JUMPER_2_NO_NO-SILK]
JP159  JUMPER-SMT_2_NO_NO-SILK  [SMT-JUMPER_2_NO_NO-SILK]
JP160  JUMPER-SMT_2_NO_NO-SILK  [SMT-JUMPER_2_NO_NO-SILK]
JP161  JUMPER-SMT_2_NO_NO-SILK  [SMT-JUMPER_2_NO_NO-SILK]
JP162  JUMPER-SMT_2_NO_NO-SILK  [SMT-JUMPER_2_NO_NO-SILK]
JP163  JUMPER-SMT_2_NO_NO-SILK  [SMT-JUMPER_2_NO_NO-SILK]
JP164  JUMPER-SMT_2_NO_NO-SILK  [SMT-JUMPER_2_NO_NO-SILK]
JP165  JUMPER-SMT_2_NO_NO-SILK  [SMT-JUMPER_2_NO_NO-SILK]
JP166  JUMPER-SMT_2_NO_NO-SILK  [SMT-JUMPER_2_NO_NO-SILK]
JP167  JUMPER-SMT_2_NO_NO-SILK  [SMT-JUMPER_2_NO_NO-SILK]
JP169  JUMPER-SMT_2_NO_NO-SILK  [SMT-JUMPER_2_NO_NO-SILK]
JP170  JUMPER-SMT_2_NO_NO-SILK  [SMT-JUMPER_2_NO_NO-SILK]
JP171  JUMPER-SMT_2_NO_NO-SILK  [SMT-JUMPER_2_NO_NO-SILK]
JP172  JUMPER-SMT_2_NO_NO-SILK  [SMT-JUMPER_2_NO_NO-SILK]
JP173  JUMPER-SMT_2_NO_NO-SILK  [SMT-JUMPER_2_NO_NO-SILK]
JP174  JUMPER-SMT_2_NO_NO-SILK  [SMT-JUMPER_2_NO_NO-SILK]
JP175  JUMPER-SMT_2_NO_NO-SILK  [SMT-JUMPER_2_NO_NO-SILK]
JP176  JUMPER-SMT_2_NO_NO-SILK  [SMT-JUMPER_2_NO_NO-SILK]
JP177  JUMPER-SMT_2_NO_NO-SILK  [SMT-JUMPER_2_NO_NO-SILK]
JP178  JUMPER-SMT_2_NO_NO-SILK  [SMT-JUMPER_2_NO_NO-SILK]
JP179  JUMPER-SMT_2_NO_NO-SILK  [SMT-JUMPER_2_NO_NO-SILK]
JP180  JUMPER-SMT_2_NO_NO-SILK  [SMT-JUMPER_2_NO_NO-SILK]
JP181  JUMPER-SMT_2_NO_NO-SILK  [SMT-JUMPER_2_NO_NO-SILK]
JP182  JUMPER-SMT_2_NO_NO-SILK  [SMT-JUMPER_2_NO_NO-SILK]
JP183  JUMPER-SMT_2_NO_NO-SILK  [SMT-JUMPER_2_NO_NO-SILK]
JP184  JUMPER-SMT_2_NO_NO-SILK  [SMT-JUMPER_2_NO_NO-SILK]
JP185  JUMPER-SMT_2_NO_NO-SILK  [SMT-JUMPER_2_NO_NO-SILK]
JP186  JUMPER-SMT_2_NO_NO-SILK  [SMT-JUMPER_2_NO_NO-SILK]
JP187  JUMPER-SMT_2_NO_NO-SILK  [SMT-JUMPER_2_NO_NO-SILK]
JP188  JUMPER-SMT_2_NO_NO-SILK  [SMT-JUMPER_2_NO_NO-SILK]
JP190  JUMPER-SMT_2_NO_NO-SILK  [SMT-JUMPER_2_NO_NO-SILK]
JP191  JUMPER-SMT_2_NO_NO-SILK  [SMT-JUMPER_2_NO_NO-SILK]
JP192  JUMPER-SMT_2_NO_NO-SILK  [SMT-JUMPER_2_NO_NO-SILK]
JP193  JUMPER-SMT_2_NO_NO-SILK  [SMT-JUMPER_2_NO_NO-SILK]
JP194  JUMPER-SMT_2_NO_NO-SILK  [SMT-JUMPER_2_NO_NO-SILK]
JP195  JUMPER-SMT_2_NO_NO-SILK  [SMT-JUMPER_2_NO_NO-SILK]
JP196  JUMPER-SMT_2_NO_NO-SILK  [SMT-JUMPER_2_NO_NO-SILK]
JP197  JUMPER-SMT_2_NO_NO-SILK  [SMT-JUMPER_2_NO_NO-SILK]
JP198  JUMPER-SMT_2_NO_NO-SILK  [SMT-JUMPER_2_NO_NO-SILK]
JP269  JUMPER-SMT_2_NO_NO-SILK  [SMT-JUMPER_2_NO_NO-SILK]
JP271  JUMPER-SMT_2_NO_NO-SILK  [SMT-JUMPER_2_NO_NO-SILK]
JP273  JUMPER-SMT_2_NO_NO-SILK  [SMT-JUMPER_2_NO_NO-SILK]
JP275  JUMPER-SMT_2_NO_NO-SILK  [SMT-JUMPER_2_NO_NO-SILK]
JP276  JUMPER-SMT_2_NO_NO-SILK  [SMT-JUMPER_2_NO_NO-SILK]
JP277  JUMPER-SMT_2_NO_NO-SILK  [SMT-JUMPER_2_NO_NO-SILK]
JP278  JUMPER-SMT_2_NO_NO-SILK  [SMT-JUMPER_2_NO_NO-SILK]

### Nets
DIO1: D100.4(DI) JP100.1 ; also sheet 2
DIO2: D198.2(DO) JP198.2 ; also sheet 4
DIO53: D103.2(DO) D104.4(DI) JP103.2 JP104.1
DIO55: D107.2(DO) D108.4(DI) JP107.2 JP108.1
DIO56: D109.2(DO) D110.4(DI) JP109.2 JP110.1
DIO57: D112.2(DO) D113.4(DI) JP112.2 JP113.1
DIO58: D114.2(DO) D115.4(DI) JP114.2 JP115.1
DIO59: D116.2(DO) D117.4(DI) JP116.2 JP117.1
DIO60: D118.2(DO) D119.4(DI) JP118.2 JP119.1
DIO61: D120.2(DO) D121.4(DI) JP120.2 JP121.1
DIO62: D121.2(DO) D122.4(DI) JP121.2 JP122.1
DIO63: D123.2(DO) D124.4(DI) JP123.2 JP124.1
DIO64: D125.2(DO) D126.4(DI) JP125.2 JP126.1
DIO65: D127.2(DO) D128.4(DI) JP127.2 JP128.1
DIO66: D129.2(DO) D130.4(DI) JP129.2 JP130.1
DIO67: D131.2(DO) D132.4(DI) JP131.2 JP132.1
DIO68: D132.2(DO) D133.4(DI) JP132.2 JP133.1
DIO69: D134.2(DO) D135.4(DI) JP134.2 JP135.1
DIO70: D136.2(DO) D137.4(DI) JP136.2 JP137.1
DIO71: D138.2(DO) D139.4(DI) JP138.2 JP139.1
DIO72: D140.2(DO) D141.4(DI) JP140.2 JP141.1
DIO73: D142.2(DO) D143.4(DI) JP142.2 JP143.1
DIO74: D143.2(DO) D144.4(DI) JP143.2 JP144.1
DIO75: D145.2(DO) D146.4(DI) JP145.2 JP146.1
DIO77: D149.2(DO) D150.4(DI) JP149.2 JP150.1
DIO78: D151.2(DO) D152.4(DI) JP151.2 JP152.1
DIO79: D153.2(DO) D154.4(DI) JP153.2 JP154.1
DIO80: D154.2(DO) D155.4(DI) JP154.2 JP155.1
DIO81: D156.2(DO) D157.4(DI) JP156.2 JP157.1
DIO82: D158.2(DO) D159.4(DI) JP158.2 JP159.1
DIO83: D275.2(DO) D276.4(DI) JP275.2 JP276.1
DIO84: D162.2(DO) D163.4(DI) JP162.2 JP163.1
DIO85: D164.2(DO) D165.4(DI) JP164.2 JP165.1
DIO86: D165.2(DO) D166.4(DI) JP165.2 JP166.1
DIO88: D169.2(DO) D170.4(DI) JP169.2 JP170.1
DIO89: D171.2(DO) D172.4(DI) JP171.2 JP172.1
DIO90: D173.2(DO) D174.4(DI) JP173.2 JP174.1
DIO91: D175.2(DO) D176.4(DI) JP175.2 JP176.1
DIO92: D176.2(DO) D177.4(DI) JP176.2 JP177.1
DIO93: D178.2(DO) D179.4(DI) JP178.2 JP179.1
DIO94: D180.2(DO) D181.4(DI) JP180.2 JP181.1
DIO95: D182.2(DO) D183.4(DI) JP182.2 JP183.1
DIO96: D184.2(DO) D185.4(DI) JP184.2 JP185.1
DIO97: D277.2(DO) D278.4(DI) JP277.2 JP278.1
DIO98: D187.2(DO) D188.4(DI) JP187.2 JP188.1
DIO100: D191.2(DO) D192.4(DI) JP191.2 JP192.1
DIO101: D193.2(DO) D194.4(DI) JP193.2 JP194.1
DIO102: D195.2(DO) D196.4(DI) JP195.2 JP196.1
DIO103: D197.2(DO) D198.4(DI) JP197.2 JP198.1
GND: D100.3(VSS) D101.3(VSS) D102.3(VSS) D103.3(VSS) D104.3(VSS) D105.3(VSS) D106.3(VSS) D107.3(VSS) D108.3(VSS) D109.3(VSS) D110.3(VSS) D111.3(VSS) D112.3(VSS) D113.3(VSS) D114.3(VSS) D115.3(VSS) D116.3(VSS) D117.3(VSS) D118.3(VSS) D119.3(VSS) D120.3(VSS) D121.3(VSS) D122.3(VSS) D123.3(VSS) D124.3(VSS) D125.3(VSS) D126.3(VSS) D127.3(VSS) D128.3(VSS) D129.3(VSS) D130.3(VSS) D131.3(VSS) D132.3(VSS) D133.3(VSS) D134.3(VSS) D135.3(VSS) D136.3(VSS) D137.3(VSS) D138.3(VSS) D139.3(VSS) D140.3(VSS) D141.3(VSS) D142.3(VSS) D143.3(VSS) D144.3(VSS) D145.3(VSS) D146.3(VSS) D147.3(VSS) D148.3(VSS) D149.3(VSS) D150.3(VSS) D151.3(VSS) D152.3(VSS) D153.3(VSS) D154.3(VSS) D155.3(VSS) D156.3(VSS) D157.3(VSS) D158.3(VSS) D159.3(VSS) D160.3(VSS) D161.3(VSS) D162.3(VSS) D163.3(VSS) D164.3(VSS) D165.3(VSS) D166.3(VSS) D167.3(VSS) D169.3(VSS) D170.3(VSS) D171.3(VSS) D172.3(VSS) D173.3(VSS) D174.3(VSS) D175.3(VSS) D176.3(VSS) D177.3(VSS) D178.3(VSS) D179.3(VSS) D180.3(VSS) D181.3(VSS) D182.3(VSS) D183.3(VSS) D184.3(VSS) D185.3(VSS) D186.3(VSS) D187.3(VSS) D188.3(VSS) D190.3(VSS) D191.3(VSS) D192.3(VSS) D193.3(VSS) D194.3(VSS) D195.3(VSS) D196.3(VSS) D197.3(VSS) D198.3(VSS) D269.3(VSS) D271.3(VSS) D273.3(VSS) D275.3(VSS) D276.3(VSS) D277.3(VSS) D278.3(VSS) ; also sheet 1,2,4
JUMPER4: D106.4(DI) D269.2(DO) JP106.1 JP269.2 ; also sheet 4
JUMPER5: D127.4(DI) D271.2(DO) JP127.1 JP271.2 ; also sheet 4
JUMPER6: D148.4(DI) D273.2(DO) JP148.1 JP273.2 ; also sheet 4
JUMPER7: D167.2(DO) D169.4(DI) JP167.2 JP169.1 ; also sheet 4
JUMPER8: D188.2(DO) D190.4(DI) JP188.2 JP190.1 ; also sheet 4
N$23: D100.2(DO) D101.4(DI) JP100.2 JP101.1
N$28: D104.2(DO) D105.4(DI) JP104.2 JP105.1
N$39: D102.2(DO) D103.4(DI) JP102.2 JP103.1
N$60: D108.2(DO) D109.4(DI) JP108.2 JP109.1
N$61: D106.2(DO) D107.4(DI) JP106.2 JP107.1
N$62: D111.2(DO) D112.4(DI) JP111.2 JP112.1
N$63: D115.2(DO) D116.4(DI) JP115.2 JP116.1
N$64: D113.2(DO) D114.4(DI) JP113.2 JP114.1
N$65: D119.2(DO) D120.4(DI) JP119.2 JP120.1
N$66: D117.2(DO) D118.4(DI) JP117.2 JP118.1
N$67: D122.2(DO) D123.4(DI) JP122.2 JP123.1
N$69: D124.2(DO) D125.4(DI) JP124.2 JP125.1
N$70: D130.2(DO) D131.4(DI) JP130.2 JP131.1
N$71: D128.2(DO) D129.4(DI) JP128.2 JP129.1
N$72: D133.2(DO) D134.4(DI) JP133.2 JP134.1
N$73: D137.2(DO) D138.4(DI) JP137.2 JP138.1
N$74: D135.2(DO) D136.4(DI) JP135.2 JP136.1
N$75: D141.2(DO) D142.4(DI) JP141.2 JP142.1
N$76: D139.2(DO) D140.4(DI) JP139.2 JP140.1
N$77: D144.2(DO) D145.4(DI) JP144.2 JP145.1
N$78: D148.2(DO) D149.4(DI) JP148.2 JP149.1
N$79: D146.2(DO) D147.4(DI) JP146.2 JP147.1
N$80: D152.2(DO) D153.4(DI) JP152.2 JP153.1
N$81: D150.2(DO) D151.4(DI) JP150.2 JP151.1
N$82: D155.2(DO) D156.4(DI) JP155.2 JP156.1
N$83: D159.2(DO) D160.4(DI) JP159.2 JP160.1
N$84: D157.2(DO) D158.4(DI) JP157.2 JP158.1
N$85: D163.2(DO) D164.4(DI) JP163.2 JP164.1
N$86: D161.2(DO) D162.4(DI) JP161.2 JP162.1
N$87: D166.2(DO) D167.4(DI) JP166.2 JP167.1
N$88: D170.2(DO) D171.4(DI) JP170.2 JP171.1
N$90: D174.2(DO) D175.4(DI) JP174.2 JP175.1
N$91: D172.2(DO) D173.4(DI) JP172.2 JP173.1
N$92: D177.2(DO) D178.4(DI) JP177.2 JP178.1
N$93: D181.2(DO) D182.4(DI) JP181.2 JP182.1
N$94: D179.2(DO) D180.4(DI) JP179.2 JP180.1
N$95: D185.2(DO) D186.4(DI) JP185.2 JP186.1
N$96: D183.2(DO) D184.4(DI) JP183.2 JP184.1
N$98: D192.2(DO) D193.4(DI) JP192.2 JP193.1
N$99: D190.2(DO) D191.4(DI) JP190.2 JP191.1
N$100: D196.2(DO) D197.4(DI) JP196.2 JP197.1
N$101: D194.2(DO) D195.4(DI) JP194.2 JP195.1
N$107: D101.2(DO) D102.4(DI) JP101.2 JP102.1
N$134: D110.2(DO) D111.4(DI) JP110.2 JP111.1
N$145: D105.2(DO) D269.4(DI) JP105.2 JP269.1
N$146: D126.2(DO) D271.4(DI) JP126.2 JP271.1
N$148: D147.2(DO) D273.4(DI) JP147.2 JP273.1
N$149: D161.4(DI) D276.2(DO) JP161.1 JP276.2
N$150: D160.2(DO) D275.4(DI) JP160.2 JP275.1
N$151: D187.4(DI) D278.2(DO) JP187.1 JP278.2
N$152: D186.2(DO) D277.4(DI) JP186.2 JP277.1
V_USB: D100.1(VDD) D101.1(VDD) D102.1(VDD) D103.1(VDD) D104.1(VDD) D105.1(VDD) D106.1(VDD) D107.1(VDD) D108.1(VDD) D109.1(VDD) D110.1(VDD) D111.1(VDD) D112.1(VDD) D113.1(VDD) D114.1(VDD) D115.1(VDD) D116.1(VDD) D117.1(VDD) D118.1(VDD) D119.1(VDD) D120.1(VDD) D121.1(VDD) D122.1(VDD) D123.1(VDD) D124.1(VDD) D125.1(VDD) D126.1(VDD) D127.1(VDD) D128.1(VDD) D129.1(VDD) D130.1(VDD) D131.1(VDD) D132.1(VDD) D133.1(VDD) D134.1(VDD) D135.1(VDD) D136.1(VDD) D137.1(VDD) D138.1(VDD) D139.1(VDD) D140.1(VDD) D141.1(VDD) D142.1(VDD) D143.1(VDD) D144.1(VDD) D145.1(VDD) D146.1(VDD) D147.1(VDD) D148.1(VDD) D149.1(VDD) D150.1(VDD) D151.1(VDD) D152.1(VDD) D153.1(VDD) D154.1(VDD) D155.1(VDD) D156.1(VDD) D157.1(VDD) D158.1(VDD) D159.1(VDD) D160.1(VDD) D161.1(VDD) D162.1(VDD) D163.1(VDD) D164.1(VDD) D165.1(VDD) D166.1(VDD) D167.1(VDD) D169.1(VDD) D170.1(VDD) D171.1(VDD) D172.1(VDD) D173.1(VDD) D174.1(VDD) D175.1(VDD) D176.1(VDD) D177.1(VDD) D178.1(VDD) D179.1(VDD) D180.1(VDD) D181.1(VDD) D182.1(VDD) D183.1(VDD) D184.1(VDD) D185.1(VDD) D186.1(VDD) D187.1(VDD) D188.1(VDD) D190.1(VDD) D191.1(VDD) D192.1(VDD) D193.1(VDD) D194.1(VDD) D195.1(VDD) D196.1(VDD) D197.1(VDD) D198.1(VDD) D269.1(VDD) D271.1(VDD) D273.1(VDD) D275.1(VDD) D276.1(VDD) D277.1(VDD) D278.1(VDD) ; also sheet 1,2,4